# Altium project Antenna_base.PrjPcb
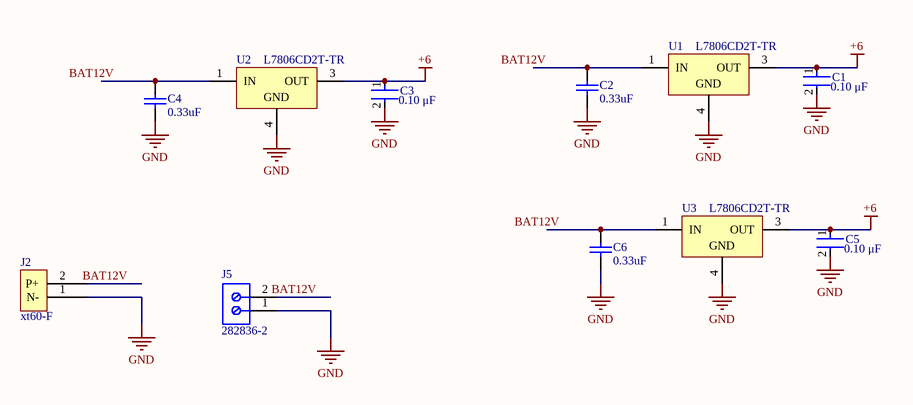
[diagram p0: 01_powersupply.SchDoc]
6 sheets, 95 parts. Net scope: global (net labels, ports and power ports of the same name join across sheets).
Board file: Antenna_base.PcbDoc
Sheets:
  01_powersupply.SchDoc
  02_USB2UART.SchDoc
  03_pushswitch.SchDoc
  04_IMU.SchDoc
  05_PWMdriver.SchDoc
  08_CoreBoard.SchDoc

## Sheet 01_powersupply.SchDoc
size A

### Parts
C1  Capacitance: 0.10 μF  [FP-C0603C-CF-MFG]  (hidden comment: C0603C104M4RAC7411)
C2  value 0.33uF  [CAPC1608X90X20LL10]  (hidden comment: C1608X7R1H334K080AC)
C3  Capacitance: 0.10 μF  [FP-C0603C-CF-MFG]  (hidden comment: C0603C104M4RAC7411)
C4  value 0.33uF  [CAPC1608X90X20LL10]  (hidden comment: C1608X7R1H334K080AC)
C5  Capacitance: 0.10 μF  [FP-C0603C-CF-MFG]  (hidden comment: C0603C104M4RAC7411)
C6  value 0.33uF  [CAPC1608X90X20LL10]  (hidden comment: C1608X7R1H334K080AC)
J2  xt60-F  [XT60H-F]
J5  282836-2  [TECO-282836-2_V]
U1  L7806CD2T-TR  [TO-263_L]
U2  L7806CD2T-TR  [TO-263_L]
U3  L7806CD2T-TR  [TO-263_L]

### Nets
+6: C1.1 C3.1 C5.1 U1.3(OUT) U2.3(OUT) U3.3(OUT)  [project net PWM_VDD]
GND: C1.2 C2.1 C3.2 C4.1 C5.2 C6.1 J2.1(N-) J5.1 U1.4(GND) U2.4(GND) U3.4(GND)
BAT12V: C2.2 C4.2 C6.2 J2.2(P+) J5.2 U1.1(IN) U2.1(IN) U3.1(IN)

### Library data of the parts
C1 C3 C5 = CMP-03020-016578-1: CAP CER 0.1UF 16V X7R 0603; Manufacturer: KEMET; Tolerance: 0.2; Value: 0.10 μF; Automotive Grade: Grade 1; Material: Ceramic; Temperature Coefficient: 30ppm/°C; RoHS: TRUE; Temperature: -55°C to +125°C; Automotive: Yes; Device Class L3: Ceramic Capacitors; Temperature Characteristic: X7R; Package: C0603C-CF; Digikey Description: CAP CER 0.1UF 16V X7R 0603; Manufacturer Part Number: C0603C104M4RAC7411; ComponentLink2URL: https://api.kemet.com/component-edge/download/datasheet/C0603C100J5GACAUTO.pdf; Mouser Description: Multilayer Ceramic Capacitors MLCC - SMD/SMT 16volts 0.1uF X7R 20%; Voltage Rating: 16 V; Temperature Range High: +125°C; Temperature Range Low: -55°C; Height: 0.87mm; Device Class L1: Passive Components; ComponentLink2Description: Datasheet; Lead Free: Yes; Category: Cap; Device Class L2: Capacitors; Octopart: https://octopart.com/c0603c104m4rac7411-kemet-9138805
C2 C4 C6 = CMP-2000-07551-1: Chip Capacitor, 0.33 uF, +/- 10%, 50 V, -55 to 125 degC, 0603 (1608 Metric), RoHS, Tape and Reel; Manufacturer: TDK; Datasheet URL: https://product.tdk.com/info/en/catalog/datasheets/mlcc_commercial_general_en.pdf; Manufacturer URL: http://www.tdk.com/; Package Description: 2-Pin Surface Mount Device, Body 1.6 x 0.8 mm; Mounting Technology: SurfaceMount; Datasheet Version: 07/2017; Package Reference: 603
J2 = xt60
J5 = CMP-1684-00017-1: Female Header, Pitch 5 mm, 1 x 2 Position, Height 10 mm, Tail Length 3.5 mm, Rohs, Bulk; Manufacturer: TE Connectivity; Wire Gauge: 16-30AWG; Product Training Modules: Wire-to-BoardEurostyleTerminalBlocks; Clamp Material - Plating: Brass-NickelPlated; Voltage: 300V; Mating Orientation: HorizontalwithBoard; Current: 13.5A; Pitch: 0.197"(5.00mm); Screw Thread: M3; 3D Model: 282836-2.pdf; Other Names: 5ULV-02B / A98076; Dynamic Catalog: BuchananSeries; Number of Levels: 1; Torque - Screw: 0.68Nm(6Lb-In); Featured Product: EurostyleTerminalBlockConnectors; Positions Per Level: 2; Wire Termination: Screw-RisingCageClamp; Datasheet URL: http://www.te.com.cn/commerce/DocumentDelivery/DDEController?Action=showdoc&DocId=Catalog+Section%7F1308389_EUROSTYLE_TERMINAL_BLOCKS%7F0607%7Fpdf%7FEnglish%7FENG_CS_1308389_EUROSTYLE_TERMINAL_BLOCKS_0607.pdf%7F282836-2; Color: Green; Family: TerminalBlocks-WiretoBoard; RoHS Information: 282836-2StatementofCompliance; Standard Package: 300; Contact Material - Plating: Brass-TinPlated; Manufacturer URL: http://www.te.com; Housing Material: Polyamide(PA66),Nylon6/6; Features: Interlocking(Side); Package Description: Female Header, Pitch 5 mm, 1 x 2 Position, Height 10 mm, Tail Length 3.5 mm; Mounting Type: ThroughHole; Package Reference: THD; Packaging: Bulk; Series: Buchanan; Category: Connectors,Interconnects; Screw Material - Plating: Brass-NickelPlated
U1-U3 = CMP-0244-00208-1: Positive Voltage Regulator, 3-Pin D2PAK, Tape and Reel; PackageDescription: 3-Pin Transistor Outline Package 2.54 mm Pitch, 15.4 mm Lead Span (D2PAK); ComponentLink1Description: Manufacturer URL; ComponentLink2URL: http://www.st.com/internet/com/TECHNICAL_RESOURCES/TECHNICAL_LITERATURE/DATASHEET/CD00000444.pdf; ComponentLink1URL: http://www.st.com; ComponentLink2Description: Datasheet; DatasheetVersion: 16/11/2011; PackageReference: TO-263; PackageVersion: 2011

## Sheet 02_USB2UART.SchDoc
size Letter
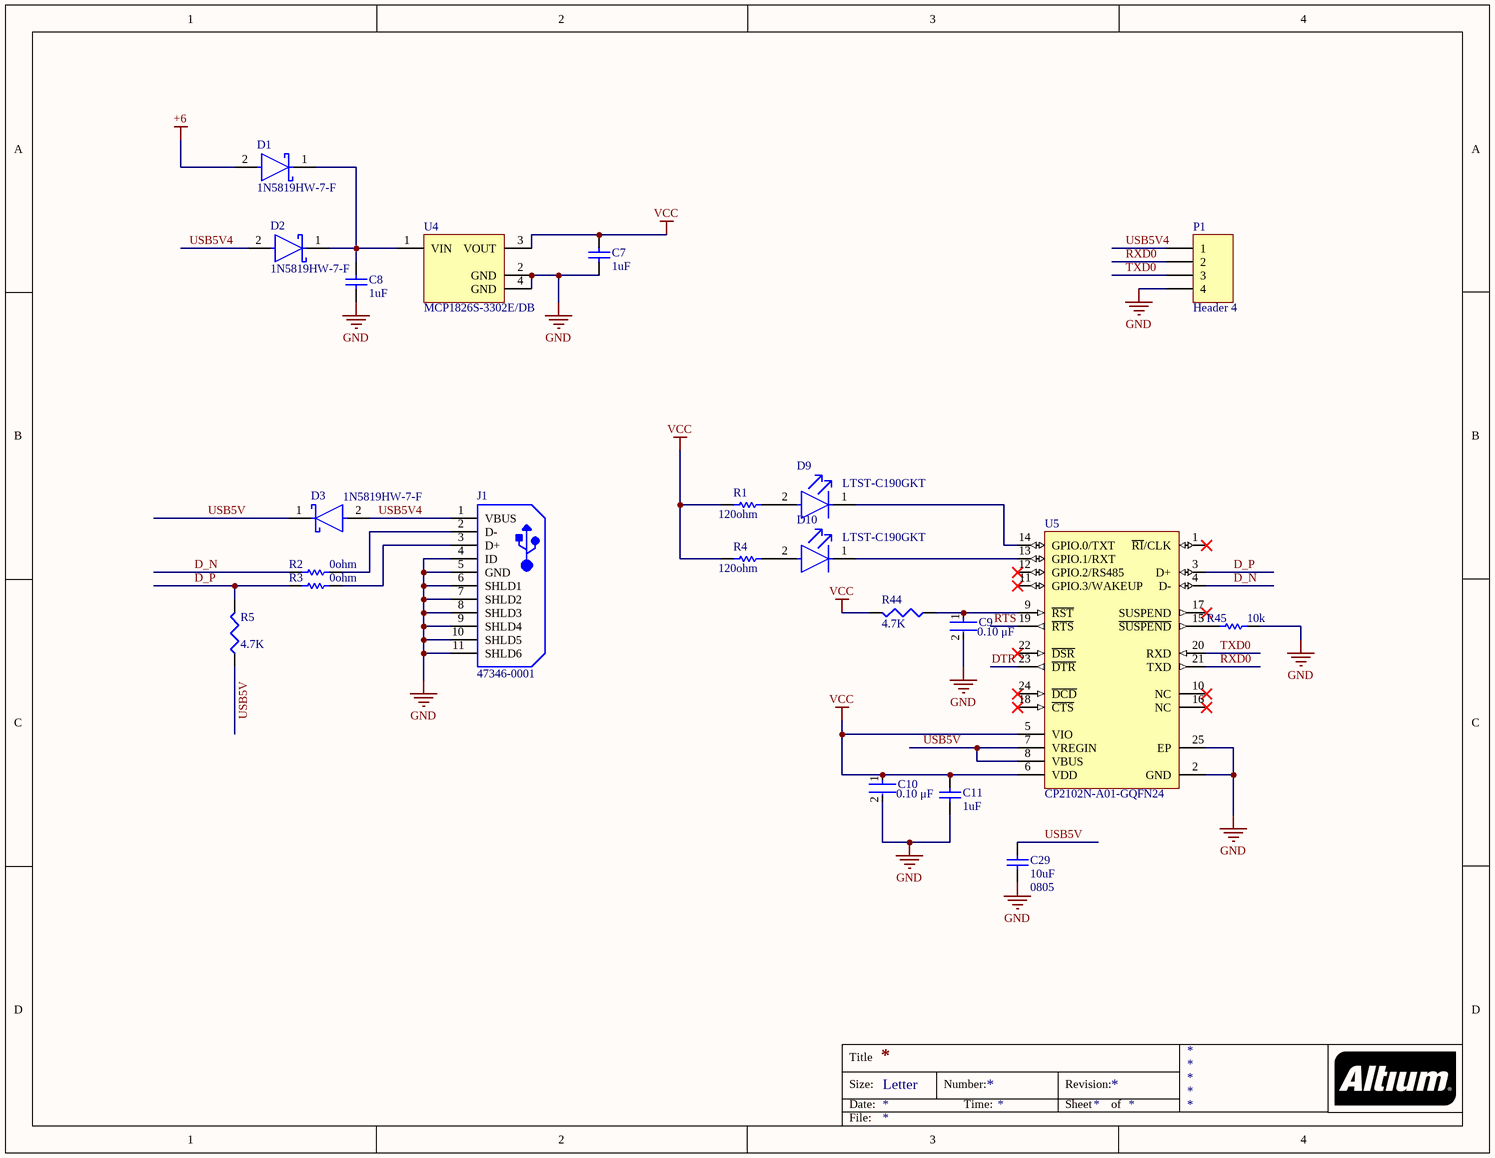
[diagram p1: 02_USB2UART.SchDoc]

### Parts
C7  value 1uF  [CAPC1608X87X35LL15T15]  (hidden comment: C0603C101J1GACTU)
C8  value 1uF  [CAPC1608X87X35LL15T15]  (hidden comment: C0603C101J1GACTU)
C9  Capacitance: 0.10 μF  [FP-C0603C-CF-MFG]  (hidden comment: C0603C104M4RAC7411)
C10  Capacitance: 0.10 μF  [FP-C0603C-CF-MFG]  (hidden comment: C0603C104M4RAC7411)
C11  value 1uF  [CAPC1608X87X35LL15T15]  (hidden comment: C0603C101J1GACTU)
C29  value 10uF  Package: 0805  [CAPC2013X135X50LL10T20]  (hidden comment: GRM21BR61C106KE15L)
D1  1N5819HW-7-F  [FP-SOD123-MFG]
D2  1N5819HW-7-F  [FP-SOD123-MFG]
D3  1N5819HW-7-F  [FP-SOD123-MFG]
D9  LTST-C190GKT  [FP-LTST-C190GKT-MFG]
D10  LTST-C190GKT  [FP-LTST-C190GKT-MFG]
J1  47346-0001  [MOLX-47346-0001-5_V]
P1  Header 4  [HDR1X4]
R1  value 120ohm  [RESC1608X55X30NL20T20]  (hidden comment: ERA-3AEB121V)
R2  value 0ohm  [RESC1608X55X25ML10T15]  (hidden comment: RC0603JR-070RL)
R3  value 0ohm  [RESC1608X55X25ML10T15]  (hidden comment: RC0603JR-070RL)
R4  value 120ohm  [RESC1608X55X30NL20T20]  (hidden comment: ERA-3AEB121V)
R5  4.7k  [J1-0603]
R44  4.7k  [J1-0603]
R45  value 10k  [RESC1609X55X30LL15T15]  (hidden comment: ERJ3EKF1002V)
U4  MCP1826S-3302E/DB  [SOT-223-DB3_L]
U5  CP2102N-A01-GQFN24  [SLAB-QFN-24-2550x2550TP_A_V]

### Nets
+6: D1.2(A)  [project net PWM_VDD]
GND: C7.1 C8.1 C9.2 C10.2 C11.1 C29.1 J1.4(ID) J1.5(GND) J1.6(SHLD1) J1.7(SHLD2) J1.8(SHLD3) J1.9(SHLD4) J1.10(SHLD5) J1.11(SHLD6) P1.4 R45.2 U4.2(GND) U4.4(GND) U5.2(GND) U5.25(EP)
VCC: C7.2 C10.1 C11.2 R1.1 R4.1 R44.2 U4.3(VOUT) U5.5(VIO) U5.6(VDD)
D_N: R2.1 U5.4(D-)
D_P: R3.1 R5.2 U5.3(D+)
DTR: U5.23(~{DTR})
RTS: U5.19(~{RTS})
RXD0: P1.2 U5.21(TXD)
TXD0: P1.3 U5.20(RXD)
USB5V: C29.2 D3.1(C) R5.1 U5.7(VREGIN) U5.8(VBUS)
USB5V4: D2.2(A) D3.2(A) J1.1(VBUS) P1.1
NetC8_2: C8.2 D1.1(C) D2.1(C) U4.1(VIN)
NetC9_1: C9.1 R44.1 U5.9(~{RST})
NetD9_1: D9.1(C) U5.14(GPIO.0/TXT)
NetD9_2: D9.2(A) R1.2
NetD10_1: D10.1(C) U5.13(GPIO.1/RXT)
NetD10_2: D10.2(A) R4.2
NetJ1_2: J1.2(D-) R2.2
NetJ1_3: J1.3(D+) R3.2
NetR45_1: R45.1 U5.15(~{SUSPEND})

Not connected (* = marked no-connect by the designer): U5 1(~{RI}/CLK)* 10(NC)* 11(GPIO.3/WAKEUP)* 12(GPIO.2/RS485)* 16(NC)* 17(SUSPEND)* 18(~{CTS})* 22(~{DSR})* 24(~{DCD})*

### Notes on the sheet
- Title
- Size:
- Date:
- Letter
- Number:
- Time:
- Revision:
- Sheet
- of
- File:

### Library data of the parts
C7 C8 C11 = CMP-2006-03318-1: Manufacturer: Kemet; Part Number: C0603C101J1GACTU
C9 C10 = CMP-03020-016578-1: as C1 on sheet 01_powersupply; RoHS: TRUE; Temperature: -55°C to +125°C; Automotive: Yes; Device Class L3: Ceramic Capacitors; Temperature Characteristic: X7R; Package: C0603C-CF; Digikey Description: CAP CER 0.1UF 16V X7R 0603; Manufacturer Part Number: C0603C104M4RAC7411; ComponentLink2URL: https://api.kemet.com/component-edge/download/datasheet/C0603C100J5GACAUTO.pdf; Mouser Description: Multilayer Ceramic Capacitors MLCC - SMD/SMT 16volts 0.1uF X7R 20%; Voltage Rating: 16 V; Temperature Range High: +125°C; Temperature Range Low: -55°C; Height: 0.87mm; Device Class L1: Passive Components; ComponentLink2Description: Datasheet; Lead Free: Yes; Category: Cap; Device Class L2: Capacitors; Octopart: https://octopart.com/c0603c104m4rac7411-kemet-9138805
C29 = CMP-2007-03453-1: Manufacturer: Murata; Part Number: GRM21BR61C106KE15L
D1-D3 = CMP-12790-000018-1: DIODE SCHOTTKY 40V 1A SOD123; Manufacturer: Diodes Inc; Max Surge Forward Current: 25A; Peak Reverse Current: 1mA; Max Junction Temp: +125°C; Import Ts: 1521843113; Vr V: 40; Standoff Height: 0mm; Capacitance: 50pF; Value: 50pF; Ciiva Ids: 815630; If A: 1; Automotive: No; Device Class L1: Discrete Semiconductors; Octopart: https://octopart.com/1n5819hw-7-f-diodes+inc.-323197; Terminal Temperature Tt Degc: 90; ComponentLink2Description: Datasheet; Temperature Range High: +125°C; Package: SOD123; Reverse Voltage: 40V; Temperature Range Low: -65°C; Mouser Description: 1N5819HW Series 40 V 1 A Surface Mount Schottky Barrier Rectifier - SOD-123; Device Class L2: Diodes; Lead Free: Yes; Max Repetitive Reverse Voltage: 40V; Ipc Land Pattern Name: SOD365155X123-2; Forward Current: 1A; Device Class L3: Schottky Diodes; Digikey Description: DIODE SCHOTTKY 40V 1A SOD123; ComponentLink2URL: https://www.diodes.com/assets/Datasheets/ds30217.pdf; Footprint Url: https://www.diodes.com/assets/Package-Files/SOD123.pdf; RoHS: TRUE; Category: Diode; Height: 1.45mm; Release Date: 1385348939; Manufacturer Part Number: 1N5819HW-7-F; Temperature: -65°C to +125°C
D9 D10 = CMP-22017-000005-1: LED GREEN CLEAR CHIP SMD; Reverse Voltage: 5V; Power Dissipation: 100mW; Forward Voltage: 2.1V; Test Current: 10mA; Number of LEDs: 1; Viewing Angle: 130°; Forward Current: 30mA; Voltage: 2V; Wavelength: 565nm; Dominant Wavelength: 569nm; Luminous Intensity: 6mcd; Lens Color: Colorless; Packaging: Tape and Reel; Lens Transparency: Clear; Min Operating Temperature: -55°C; Case Code (Metric): 1608; Lens Style: Clear; Case/Package: 0603; Mount: Surface Mount; Package Quantity: 1; Height: 0.8mm; Illumination Color: Green; Radiation Hardening: No; Depth: 0.8mm; Number of Pins: 2; Max Operating Temperature: 85°C; Color: Green; Number of Elements: 1; Power Rating: 100mW; Case Code (Imperial): 0603; Width: 0.8mm; Length: 1.6mm; Lead Free: Lead Free
J1 = CMP-2000-05246-1: Micro-USB B Receptacle with Flange, -30 to 85 degC, 5-Pin SMD, RoHS, Tape and Reel; Manufacturer: Molex; Number of Contacts: 5; Body Orientation: RightAngle; Maximum Voltage Rating: 30VAC; Pitch: 0.65mm; Maximum Current Rating: 1.8/ContactA; Number of Ports: 1; Gender: RCP; Operating Temperature: -30to85C; Part No: 47346-0001; Color: Black; Termination Method: Solder; Contact Plating: GoldOverPalladiumNickelOverNickel; Dimension: 7.8x5.43x2.94mm; Number of Terminals: 5; Datasheet Version: Dec-13; Datasheet URL: https://datasheet.ciiva.com/30075/304740473460001-io-nectors-30075527.pdf; Contact Material: CopperAlloy; RoHS: Yes; Housing Material: LiquidCrystalPolymer; Manufacturer URL: http://www.molex.com/; Packaging: EmbossedTapeandReel; Mounting: SurfaceMount; Type: MicroUSBTypeB
P1 = Header 4: Header, 4-Pin; LatestRevisionDate: 17-Jul-2002; LatestRevisionNote: Re-released for DXP Platform.; Publisher: Altium Limited
R1 R4 = CMP-2000-00896-1: Manufacturer: Panasonic; Part Number: ERA-3AEB121V
R2 R3 = CMP-2100-03667-1: Chip Resistor, 0 Ohm, +/- 5%, 0.1 W, -55 to 155 degC, 0603 (1608 Metric), RoHS, Tape and Reel; Manufacturer: Yageo; Temperature Coefficient: 200ppm/degreesC; Voltage Rating: 50V; Power Rating: 100mW; Resistance: 0mOhm; Width: 0.8mm; Max Operating Temperature: 155degC; Tolerance: 5%; Package Reference: 0603; Height: 0.45mm; Depth: 0.8mm; Package Description: 2-Pin Surface Mount Device, Body 1.6 x 0.8 mm; Termination: SMD/SMT; Package Quantity: 5000; Case/Package: 0603; Case Code (Imperial): 0603; Radiation Hardening: No; Number of Pins: 2; Length: 1.6mm; Lead Free: LeadFree; Voltage Rating (DC): 50V; Military Standard: Not; Datasheet URL: http://www.yageo.com/NewPortal/yageodocoutput?fileName=/pdf/R-Chip/PYu-RC_Group_51_RoHS_L_5.pdf; Manufacturer URL: http://www.yageo.com/; Packaging: TapeandReel; Case Code (Metric): 1608; Min Operating Temperature: -55degC; Composition: ThickFilm; RoHSCompliant: true; Contact Plating: Tin; Datasheet Version: Rev. 5, 10/2016; REACH SVHC: NoSVHC
R5 R44 = Res3: Resistor; Published: 8-Jun-2000; LatestRevisionDate: 29-May-2009; LatestRevisionNote: IPC-7351 Footprint Added.; PackageReference: J1-0603; Publisher: Altium Limited; PackageDescription: Chip Resistor; Value: 4.7K
R45 = CMP-2000-07452-1: Chip Resistor, 10 KOhm, +/- 1%, 0.1 W, -55 to 155 degC, 0603 (1608 Metric), RoHS, Tape and Reel; Manufacturer: Panasonic; Voltage Rating: 75V; Case\/Package: 0603; Power Rating: 100mW; Resistance: 10KOhm; Temperature Coefficient: 100ppm\/degreesC; Number of Pins: 2; Package Reference: 603; Depth: 0.8mm; Mount: SurfaceMount; Package Description: 2-Pin Surface Mount Device, Body 1.6 x 0.85 mm; Datasheet Version: 02/2017; Length: 1.6mm; Lead Free: LeadFree; Height: 0.45mm; Number of Terminations: 2; Max Power Dissipation: 100mW; Min Operating Temperature: -55degC; Datasheet URL: https://industrial.panasonic.com/cdbs/www-data/pdf/RDA0000/AOA0000C304.pdf; Termination: SMD/SMT; Case Code (Metric): 1608; Case Code (Imperial): 0603; Tolerance: 1%; Max Operating Temperature: 155degC; RoHSCompliant: true; Voltage Rating (DC): 75V; Radiation Hardening: No; Packaging: TapeandReel; Composition: ThickFilm; Mounting Technology: SurfaceMount; Manufacturer URL: http://www.panasonic.com/; Width: 0.031inch; REACH SVHC: NoSVHC; Contact Plating: Tin; Military Standard: Not; Package Quantity: 1
U4 = CMP-0136-00504-1: 1000 mA, Low Voltage, Low Quiescent Current LDO Regulator, 3-Pin SOT-223, Extended Temperature; PackageVersion: revBB, Aug-2009; PackageReference: SOT-223-DB3; DatasheetVersion: revA, Aug-2007; PackageDescription: 3-Lead Plastic Small Outline Transistor (DB) [SOT-223]
U5 = CMP-2000-07570-1: USBXpress(TM) Family, 4 GPIOs, 2.2 to 3.6 V, -40 to 85 degC, 24-Pin QFN, RoHS; Manufacturer: Silicon Labs; Max Supply Voltage: 3.6V; Min Supply Voltage: 3V; Datasheet Version: Rev. 1.1, 08/2016; Max Operating Temperature: 85degC; Case\/Package: QFN; Number of Pins: 24; Min Operating Temperature: -40degC; Mounting Technology: SurfaceMount; Manufacturer URL: http://www.silabs.com/; RoHSCompliant: False; Package Reference: QFN-24-2550x2550TP_A; Datasheet URL: http://www.silabs.com/documents/public/data-sheets/cp2102n-datasheet.pdf; Package Description: 24-Pin Quad Flat No-lead Package, Body 4 x 4 mm, Pitch 0.5 mm; REACH SVHC: Unknown

## Sheet 03_pushswitch.SchDoc
size A
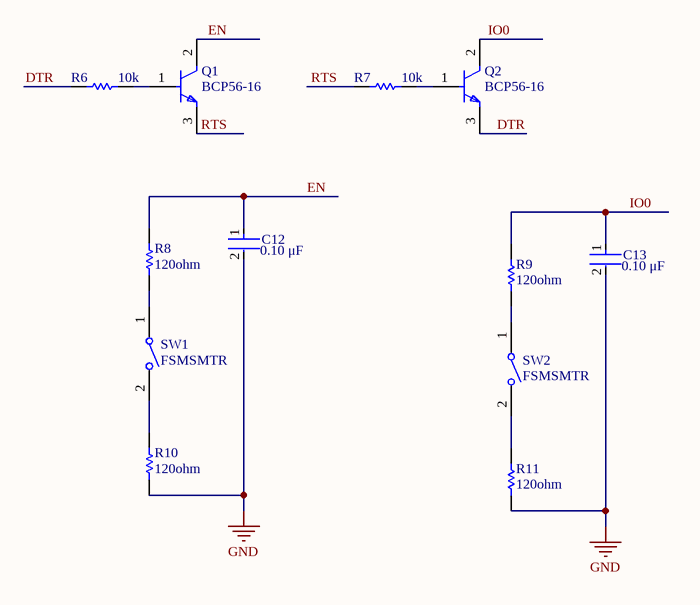
[diagram p2: 03_pushswitch.SchDoc]

### Parts
C12  Capacitance: 0.10 μF  [FP-C0603C-CF-MFG]  (hidden comment: C0603C104M4RAC7411)
C13  Capacitance: 0.10 μF  [FP-C0603C-CF-MFG]  (hidden comment: C0603C104M4RAC7411)
Q1  BCP56-16  [FP-SOT-223-P008-MFG]
Q2  BCP56-16  [FP-SOT-223-P008-MFG]
R6  value 10k  [RESC1609X55X30LL15T15]  (hidden comment: ERJ3EKF1002V)
R7  value 10k  [RESC1609X55X30LL15T15]  (hidden comment: ERJ3EKF1002V)
R8  value 120ohm  [RESC1608X55X30NL20T20]  (hidden comment: ERA-3AEB121V)
R9  value 120ohm  [RESC1608X55X30NL20T20]  (hidden comment: ERA-3AEB121V)
R10  value 120ohm  [RESC1608X55X30NL20T20]  (hidden comment: ERA-3AEB121V)
R11  value 120ohm  [RESC1608X55X30NL20T20]  (hidden comment: ERA-3AEB121V)
SW1  FSMSMTR  [TECO-FSMSMTR_V]
SW2  FSMSMTR  [TECO-FSMSMTR_V]

### Nets
GND: C12.2 C13.2 R10.1 R11.1
DTR: Q2.3(E) R6.1
EN: C12.1 Q1.2(C) R8.2
IO0: C13.1 Q2.2(C) R9.2
RTS: Q1.3(E) R7.1
NetQ1_1: Q1.1(B) R6.2
NetQ2_1: Q2.1(B) R7.2
NetR8_1: R8.1 SW1.1
NetR9_1: R9.1 SW2.1
NetR10_2: R10.2 SW1.2
NetR11_2: R11.2 SW2.2

### Library data of the parts
C12 C13 = CMP-03020-016578-1: as C1 on sheet 01_powersupply; RoHS: TRUE; Temperature: -55°C to +125°C; Automotive: Yes; Device Class L3: Ceramic Capacitors; Temperature Characteristic: X7R; Package: C0603C-CF; Digikey Description: CAP CER 0.1UF 16V X7R 0603; Manufacturer Part Number: C0603C104M4RAC7411; ComponentLink2URL: https://api.kemet.com/component-edge/download/datasheet/C0603C100J5GACAUTO.pdf; Mouser Description: Multilayer Ceramic Capacitors MLCC - SMD/SMT 16volts 0.1uF X7R 20%; Voltage Rating: 16 V; Temperature Range High: +125°C; Temperature Range Low: -55°C; Height: 0.87mm; Device Class L1: Passive Components; ComponentLink2Description: Datasheet; Lead Free: Yes; Category: Cap; Device Class L2: Capacitors; Octopart: https://octopart.com/c0603c104m4rac7411-kemet-9138805
Q1 Q2 = CMP-12195-000003-1: TRANS NPN 80V 1A SOT-223; Manufacturer: STMicroelectronics; Number Of Npn: 1; Hfe Max: 250; Hfe Min: 100; Power Dissipation: 1.6W; Collector Base Voltage: 100V; Emitter Base Voltage: 5V; Max Junction Temp: +150°C; Rthja Max: 78°C/W; Standoff Height: 0.02mm; Collector Emitter Saturation Voltage: 0.5V; Hfe Testvce: 2V; Hfe Testic: 150mA; Package: SOT-223-P008; Octopart: https://octopart.com/bcp56-16-stmicroelectronics-13883839; Digikey Description: TRANS NPN 80V 1A SOT-223; RoHS: TRUE; Device Class L1: Discrete Semiconductors; Manufacturer Part Number: BCP56-16; Collector Emitter Voltage: 80V; Mouser Description: BCP56 Series 80 V 1 A 1.6 W Surface Mount Low Power NPN Transistor - SOT-223; Collector Emitter Breakdown Voltage: 80V; Category: Trans; Automotive: No; Ipc Land Pattern Name: SOT230P700X180-4; Temperature: to +150°C; Number Of Elements: 1; Footprint Url: https://www.st.com/content/ccc/resource/technical/document/application_note/45/cc/69/ea/2f/8d/4e/3c/CD00004438.pdf/files/CD00004438.pdf/jcr:content/translations/en.CD00004438.pdf; ComponentLink2URL: https://www.st.com/resource/en/datasheet/bcp56-16.pdf; Device Class L2: Transistors; Temperature Range High: +150°C; Device Class L3: BJTs; Height: 1.82mm; ComponentLink2Description: Datasheet; Lead Free: Yes; Max Collector Current: 1A
R6 R7 = CMP-2000-07452-1: as R45 on sheet 02_USB2UART; Number of Pins: 2; Package Reference: 603; Depth: 0.8mm; Mount: SurfaceMount; Package Description: 2-Pin Surface Mount Device, Body 1.6 x 0.85 mm; Datasheet Version: 02/2017; Length: 1.6mm; Lead Free: LeadFree; Height: 0.45mm; Number of Terminations: 2; Max Power Dissipation: 100mW; Min Operating Temperature: -55degC; Datasheet URL: https://industrial.panasonic.com/cdbs/www-data/pdf/RDA0000/AOA0000C304.pdf; Termination: SMD/SMT; Case Code (Metric): 1608; Case Code (Imperial): 0603; Tolerance: 1%; Max Operating Temperature: 155degC; RoHSCompliant: true; Voltage Rating (DC): 75V; Radiation Hardening: No; Packaging: TapeandReel; Composition: ThickFilm; Mounting Technology: SurfaceMount; Manufacturer URL: http://www.panasonic.com/; Width: 0.031inch; REACH SVHC: NoSVHC; Contact Plating: Tin; Military Standard: Not; Package Quantity: 1
R8-R11 = CMP-2000-00896-1: Manufacturer: Panasonic; Part Number: ERA-3AEB121V
SW1 SW2 = CMP-2000-07501-1: FSMSM Push Button Switch, 50 mA, -35 to 85 degC, 2-Pin SMD, RoHS, Tape and Reel; Manufacturer: TE Connectivity; Voltage Rating (DC): 24V; Electrical Life: 20000Cycles; Operating Force: 180gf; Switch Travel: 0.25mm; Contact Current Rating: 50mA; Case\/Package: SMD/SMT; Actuator Length: 1.07mm; Throw Configuration: SPST; Actuator Material: Polyamide; Contact Resistance: 100mOhm; Illumination Type: Illuminated; Max Voltage Rating (DC): 12V; Manufacturer URL: http://www.te.com/; Lead Free: LeadFree; Packaging: TapeandReel; Min Operating Temperature: -35degC; Mechanical Life: 20000Cycles; Mount: SurfaceMount; REACH SVHC: Unknown; Package Quantity: 1800; Package Reference: FSMSMTR; RoHSCompliant: true; Max Operating Temperature: 85degC; Orientation: Straight; ELV: Compliant; Datasheet URL: http://www.te.com/commerce/DocumentDelivery/DDEController?Action=showdoc&DocId=Customer+Drawing%7F1437566-3%7FC2%7Fpdf%7FEnglish%7FENG_CD_1437566-3_C2_1437566_3_1_c.dwg.pdf%7F1437566-4; Package Description: 2-Pin Surface Mount Device, Body 6 x 3.5 mm, Pitch 9.19 mm; Current Rating: 50mA; Contact Plating: Silver; Termination: GullWing; Datasheet Version: Rev. C2, 08/2014; Contact Material: Brass; Mounting Technology: SurfaceMount

## Sheet 04_IMU.SchDoc
size A
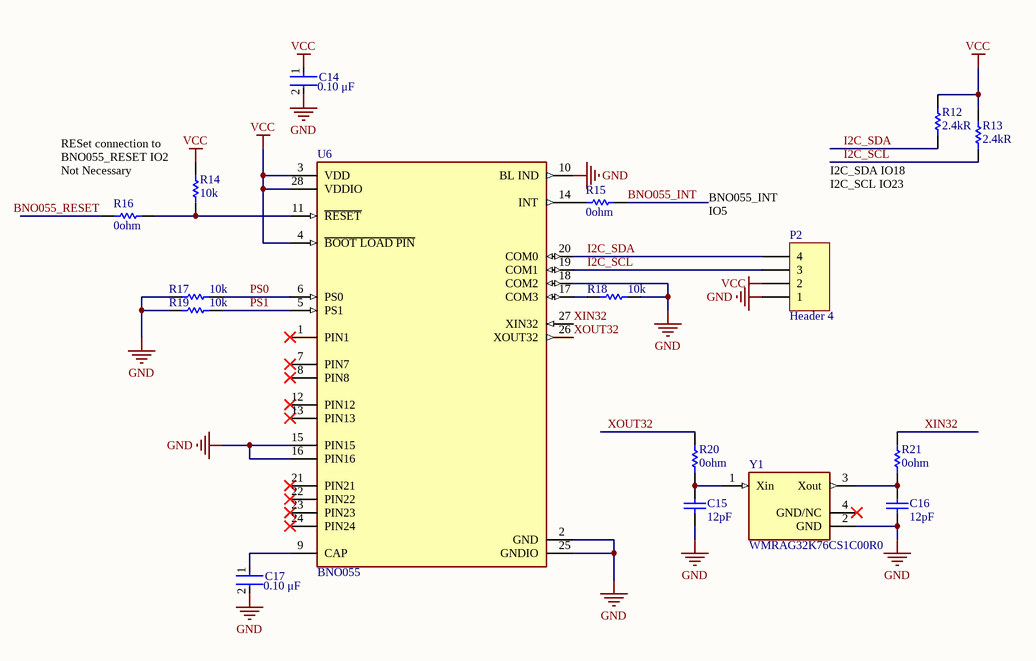
[diagram p3: 04_IMU.SchDoc]

### Parts
C14  Capacitance: 0.10 μF  [FP-C0603C-CF-MFG]  (hidden comment: C0603C104M4RAC7411)
C15  value 12pF  [CAPC1608X90X40NL10T20]  (hidden comment: CC0603JRNPO9BN120)
C16  value 12pF  [CAPC1608X90X40NL10T20]  (hidden comment: CC0603JRNPO9BN120)
C17  Capacitance: 0.10 μF  [FP-C0603C-CF-MFG]  (hidden comment: C0603C104M4RAC7411)
P2  Header 4  [HDR1X4]
R12  value 2.4kR  [RESC1608X50X30ML20T20]  (hidden comment: RR0816P-242-D)
R13  value 2.4kR  [RESC1608X50X30ML20T20]  (hidden comment: RR0816P-242-D)
R14  value 10k  [RESC1609X55X30LL15T15]  (hidden comment: ERJ3EKF1002V)
R15  value 0ohm  [RESC1608X55X25ML10T15]  (hidden comment: RC0603JR-070RL)
R16  value 0ohm  [RESC1608X55X25ML10T15]  (hidden comment: RC0603JR-070RL)
R17  value 10k  [RESC1609X55X30LL15T15]  (hidden comment: ERJ3EKF1002V)
R18  value 10k  [RESC1609X55X30LL15T15]  (hidden comment: ERJ3EKF1002V)
R19  value 10k  [RESC1609X55X30LL15T15]  (hidden comment: ERJ3EKF1002V)
R20  value 0ohm  [RESC1608X55X25ML10T15]  (hidden comment: RC0603JR-070RL)
R21  value 0ohm  [RESC1608X55X25ML10T15]  (hidden comment: RC0603JR-070RL)
U6  BNO055  [FP-BNO055-MFG]
Y1  WMRAG32K76CS1C00R0  [FP-WMRAG32K76CS1C00R0-MFG]

### Nets
GND: C14.2 C15.1 C16.1 C17.2 P2.1 R17.1 R18.1 R19.1 U6.2(GND) U6.10(BL_IND) U6.15(PIN15) U6.16(PIN16) U6.18(COM2) U6.25(GNDIO) Y1.2(GND)
VCC: C14.1 P2.2 R12.2 R13.2 R14.2 U6.3(VDD) U6.4(~{BOOT_LOAD_PIN}) U6.28(VDDIO)
BNO055_INT: R15.2
BNO055_RESET: R16.1
I2C_SCL: P2.3 R13.1 U6.19(COM1)
I2C_SDA: P2.4 R12.1 U6.20(COM0)
PS0: R17.2 U6.6(PS0)
PS1: R19.2 U6.5(PS1)
XIN32: R21.1 U6.27(XIN32)
XOUT32: R20.1 U6.26(XOUT32)
NetC15_2: C15.2 R20.2 Y1.1(Xin)
NetC16_2: C16.2 R21.2 Y1.3(Xout)
NetC17_1: C17.1 U6.9(CAP)
NetR14_1: R14.1 R16.2 U6.11(~{RESET})
NetR15_1: R15.1 U6.14(INT)
NetR18_2: R18.2 U6.17(COM3)

Not connected (* = marked no-connect by the designer): U6 1(PIN1)* 7(PIN7)* 8(PIN8)* 12(PIN12)* 13(PIN13)* 21(PIN21)* 22(PIN22)* 23(PIN23)* 24(PIN24)*; Y1 4(GND/NC)*

### Notes on the sheet
- RESet connection to
  BNO055_RESET IO2
  Not Necessary
- I2C_SDA IO18
  I2C_SCL IO23
- (near P2) BNO055_INT
  IO5

### Library data of the parts
C14 C17 = CMP-03020-016578-1: as C1 on sheet 01_powersupply; RoHS: TRUE; Temperature: -55°C to +125°C; Automotive: Yes; Device Class L3: Ceramic Capacitors; Temperature Characteristic: X7R; Package: C0603C-CF; Digikey Description: CAP CER 0.1UF 16V X7R 0603; Manufacturer Part Number: C0603C104M4RAC7411; ComponentLink2URL: https://api.kemet.com/component-edge/download/datasheet/C0603C100J5GACAUTO.pdf; Mouser Description: Multilayer Ceramic Capacitors MLCC - SMD/SMT 16volts 0.1uF X7R 20%; Voltage Rating: 16 V; Temperature Range High: +125°C; Temperature Range Low: -55°C; Height: 0.87mm; Device Class L1: Passive Components; ComponentLink2Description: Datasheet; Lead Free: Yes; Category: Cap; Device Class L2: Capacitors; Octopart: https://octopart.com/c0603c104m4rac7411-kemet-9138805
C15 C16 = CMP-1659-00031-1: Chip Capacitor, 12 pF, +/- 5%, 50 V, -55 to 125 degC, 0603 (1608 Metric), RoHS, Tape and Reel; Tolerance: 1%; Voltage Rating: 250 V; Case\Package: Axial; Power Rating: 250 mW; Resistance: 475 kohm; Mount: Through Hole; Length: 0.248 inch; PackageReference: 0603; DatasheetVersion: Rev. 14, 07/2016; Packaging: Bulk; Max Operating Temperature: 155 degC; Min Operating Temperature: -55 degC; ComponentLink2Description: Datasheet; ComponentLink2URL: http://www.yageo.com/NewPortal/yageodocoutput?fileName=/pdf/MLCC/UPY-GP_NP0_16V-to-50V_14.pdf; ComponentLink1URL: http://www.yageo.com/; PackageDescription: 2-Pin Surface Mount Device, Body 1.6 x 0.8 mm; Package Quantity: 200; RoHSCompliant: true; ComponentLink1Description: Manufacturer URL
P2 = Header 4: Header, 4-Pin; LatestRevisionDate: 17-Jul-2002; LatestRevisionNote: Re-released for DXP Platform.; Publisher: Altium Limited
R12 R13 = CMP-2000-02561-1: Manufacturer: Susumu; Part Number: RR0816P-242-D
R14 R17-R19 = CMP-2000-07452-1: as R45 on sheet 02_USB2UART; Number of Pins: 2; Package Reference: 603; Depth: 0.8mm; Mount: SurfaceMount; Package Description: 2-Pin Surface Mount Device, Body 1.6 x 0.85 mm; Datasheet Version: 02/2017; Length: 1.6mm; Lead Free: LeadFree; Height: 0.45mm; Number of Terminations: 2; Max Power Dissipation: 100mW; Min Operating Temperature: -55degC; Datasheet URL: https://industrial.panasonic.com/cdbs/www-data/pdf/RDA0000/AOA0000C304.pdf; Termination: SMD/SMT; Case Code (Metric): 1608; Case Code (Imperial): 0603; Tolerance: 1%; Max Operating Temperature: 155degC; RoHSCompliant: true; Voltage Rating (DC): 75V; Radiation Hardening: No; Packaging: TapeandReel; Composition: ThickFilm; Mounting Technology: SurfaceMount; Manufacturer URL: http://www.panasonic.com/; Width: 0.031inch; REACH SVHC: NoSVHC; Contact Plating: Tin; Military Standard: Not; Package Quantity: 1
R15 R16 R20 R21 = CMP-2100-03667-1: as R2 on sheet 02_USB2UART; Width: 0.8mm; Max Operating Temperature: 155degC; Tolerance: 5%; Package Reference: 0603; Height: 0.45mm; Depth: 0.8mm; Package Description: 2-Pin Surface Mount Device, Body 1.6 x 0.8 mm; Termination: SMD/SMT; Package Quantity: 5000; Case/Package: 0603; Case Code (Imperial): 0603; Radiation Hardening: No; Number of Pins: 2; Length: 1.6mm; Lead Free: LeadFree; Voltage Rating (DC): 50V; Military Standard: Not; Datasheet URL: http://www.yageo.com/NewPortal/yageodocoutput?fileName=/pdf/R-Chip/PYu-RC_Group_51_RoHS_L_5.pdf; Manufacturer URL: http://www.yageo.com/; Packaging: TapeandReel; Case Code (Metric): 1608; Min Operating Temperature: -55degC; Composition: ThickFilm; RoHSCompliant: true; Contact Plating: Tin; Datasheet Version: Rev. 5, 10/2016; REACH SVHC: NoSVHC
U6 = CMP-191067-000002-1: IMU ACCEL/GYRO/MAG I2C 28LGA; Manufacturer: Bosch Sensortech; Max Supply Voltage: 3.6V; Voltage: 1.7~3.6V; Operating Supply Current: 12.3mA; Gyro Sensitivity: 16LSB/°/s; Sensor Type: Accelerometer,Gyroscope,Magnetometer; Accel Sensitivity: 0.001LSB/g; Min Supply Voltage: 1.7V; Accel Range: 2/4/8/16g; Accel Resolution: 14bits; Sensor Output: I2C,UART; Gyro Range: 125/250/500/1000/2000°/s; Mag Sense Range: 1300-2500uT; Octopart: https://octopart.com/bno055-bosch+sensortec-50309911; Height: 1.18mm; Automotive: No; Mouser Description: BNO055 Series 1.7 to 3.6 V Intelligent 9-Axis Absolute Orientation Sensor-LGA-28; Lead Free: Yes; Temperature Range High: +85°C; Ambient Temperature Range Low: -40°C; Ambient Temperature Range High: +85°C; Device Class L1: Sensors; Device Class L3: Inertial Measurement Units (IMUs); ComponentLink2URL: https://ae-bst.resource.bosch.com/media/_tech/media/datasheets/BST-BNO055-DS000.pdf; Temperature Range Low: -40°C; Manufacturer Part Number: BNO055; Digikey Description: IMU ACCEL/GYRO/MAG I2C 28LGA; Device Class L2: Motion Sensors; RoHS: TRUE; Category: IC; Temperature: -40°C to +85°C; ComponentLink2Description: Datasheet; Package: 0
Y1 = CMP-06054-000002-1: MEMS Resonator; Manufacturer: Murata; Tolerance: 20ppm; Frequency: 32.768kHz; Esr: 75kΩ; Load Capacitance: 8pF; Temperature Range High: +85°C; Manufacturer Part Number: WMRAG32K76CS1C00R0; Device Class L2: Crystals / Oscillators; Category: Crys; ComponentLink2URL: https://www.murata.com/en-us/products/productdetail?partno=WMRAG32K76CS1C00R0; Package: WMRAG32K76CS1C00R0; Temperature: -30°C to +85°C; Automotive: No; Device Class L1: Passive Components; Octopart: https://octopart.com/wmrag32k76cs1c00r0-murata-103936783; ComponentLink2Description: Datasheet; RoHS: TRUE; Lead Free: Yes; Device Class L3: Crystals; Footprint Url: https://forum.upverter.com/uploads/default/original/3X/c/9/c928dfaf44ae48bfe51164a60c1d28063cd1860b.pdf; Temperature Range Low: -30°C

## Sheet 05_PWMdriver.SchDoc
size A
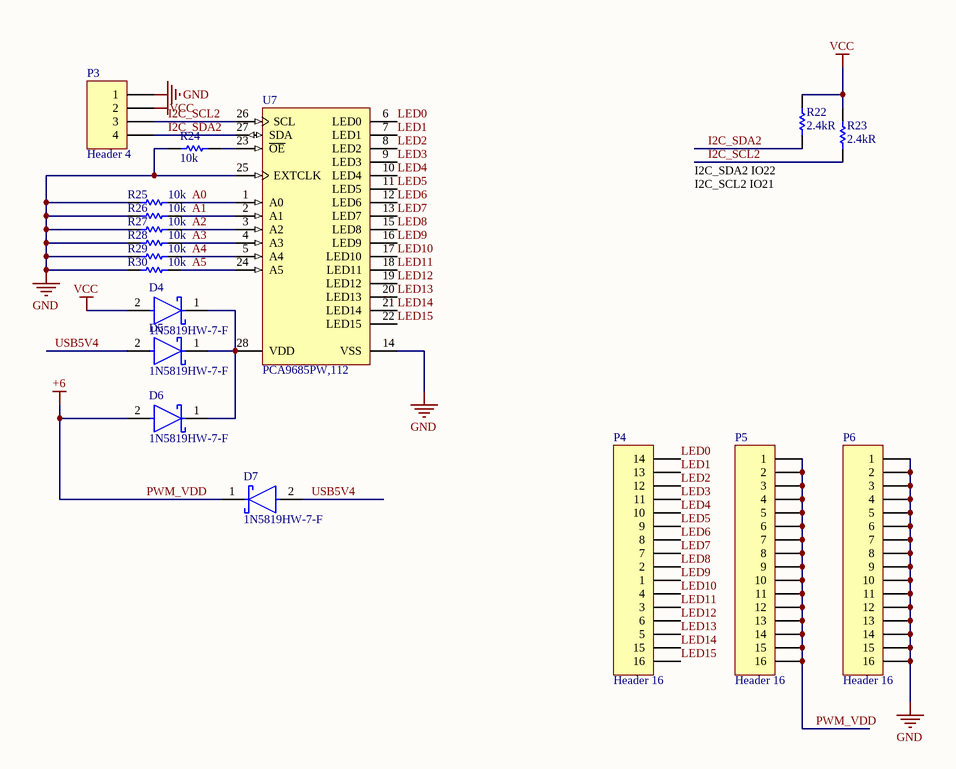
[diagram p4: 05_PWMdriver.SchDoc]

### Parts
D4  1N5819HW-7-F  [FP-SOD123-MFG]
D5  1N5819HW-7-F  [FP-SOD123-MFG]
D6  1N5819HW-7-F  [FP-SOD123-MFG]
D7  1N5819HW-7-F  [FP-SOD123-MFG]
P3  Header 4  [HDR1X4]
P4  Header 16  [HDR1X16]
P5  Header 16  [HDR1X16]
P6  Header 16  [HDR1X16]
R22  value 2.4kR  [RESC1608X50X30ML20T20]  (hidden comment: RR0816P-242-D)
R23  value 2.4kR  [RESC1608X50X30ML20T20]  (hidden comment: RR0816P-242-D)
R24  value 10k  [RESC1609X55X30LL15T15]  (hidden comment: ERJ3EKF1002V)
R25  value 10k  [RESC1609X55X30LL15T15]  (hidden comment: ERJ3EKF1002V)
R26  value 10k  [RESC1609X55X30LL15T15]  (hidden comment: ERJ3EKF1002V)
R27  value 10k  [RESC1609X55X30LL15T15]  (hidden comment: ERJ3EKF1002V)
R28  value 10k  [RESC1609X55X30LL15T15]  (hidden comment: ERJ3EKF1002V)
R29  value 10k  [RESC1609X55X30LL15T15]  (hidden comment: ERJ3EKF1002V)
R30  value 10k  [RESC1609X55X30LL15T15]  (hidden comment: ERJ3EKF1002V)
U7  PCA9685PW,112  [SOT361-1_V]

### Nets
GND: P3.1 P6.1 P6.2 P6.3 P6.4 P6.5 P6.6 P6.7 P6.8 P6.9 P6.10 P6.11 P6.12 P6.13 P6.14 P6.15 P6.16 R24.2 R25.2 R26.2 R27.2 R28.2 R29.2 R30.2 U7.14(VSS) U7.25(EXTCLK)
PWM_VDD: D6.2(A) D7.1(C) P5.1 P5.2 P5.3 P5.4 P5.5 P5.6 P5.7 P5.8 P5.9 P5.10 P5.11 P5.12 P5.13 P5.14 P5.15 P5.16  [also labelled +6]
VCC: D4.2(A) P3.2 R22.2 R23.2
A0: R25.1 U7.1(A0)
A1: R26.1 U7.2(A1)
A2: R27.1 U7.3(A2)
A3: R28.1 U7.4(A3)
A4: R29.1 U7.5(A4)
A5: R30.1 U7.24(A5)
I2C_SCL2: P3.3 R23.1 U7.26(SCL)
I2C_SDA2: P3.4 R22.1 U7.27(SDA)
LED0: P4.14 U7.6(LED0)
LED1: P4.13 U7.7(LED1)
LED2: P4.12 U7.8(LED2)
LED3: P4.11 U7.9(LED3)
LED4: P4.10 U7.10(LED4)
LED5: P4.9 U7.11(LED5)
LED6: P4.8 U7.12(LED6)
LED7: P4.7 U7.13(LED7)
LED8: P4.2 U7.15(LED8)
LED9: P4.1 U7.16(LED9)
LED10: P4.4 U7.17(LED10)
LED11: P4.3 U7.18(LED11)
LED12: P4.6 U7.19(LED12)
LED13: P4.5 U7.20(LED13)
LED14: P4.15 U7.21(LED14)
LED15: P4.16 U7.22(LED15)
USB5V4: D5.2(A) D7.2(A)
NetD4_1: D4.1(C) D5.1(C) D6.1(C) U7.28(VDD)
NetR24_1: R24.1 U7.23(~{OE})

### Notes on the sheet
- I2C_SDA2 IO22
  I2C_SCL2 IO21

### Library data of the parts
D4-D7 = CMP-12790-000018-1: as D1 on sheet 02_USB2UART; Automotive: No; Device Class L1: Discrete Semiconductors; Octopart: https://octopart.com/1n5819hw-7-f-diodes+inc.-323197; Terminal Temperature Tt Degc: 90; ComponentLink2Description: Datasheet; Temperature Range High: +125°C; Package: SOD123; Reverse Voltage: 40V; Temperature Range Low: -65°C; Mouser Description: 1N5819HW Series 40 V 1 A Surface Mount Schottky Barrier Rectifier - SOD-123; Device Class L2: Diodes; Lead Free: Yes; Max Repetitive Reverse Voltage: 40V; Ipc Land Pattern Name: SOD365155X123-2; Forward Current: 1A; Device Class L3: Schottky Diodes; Digikey Description: DIODE SCHOTTKY 40V 1A SOD123; ComponentLink2URL: https://www.diodes.com/assets/Datasheets/ds30217.pdf; Footprint Url: https://www.diodes.com/assets/Package-Files/SOD123.pdf; RoHS: TRUE; Category: Diode; Height: 1.45mm; Release Date: 1385348939; Manufacturer Part Number: 1N5819HW-7-F; Temperature: -65°C to +125°C
P3 = Header 4: Header, 4-Pin; LatestRevisionDate: 17-Jul-2002; LatestRevisionNote: Re-released for DXP Platform.; Publisher: Altium Limited
P4-P6 = Header 16: Header, 16-Pin; LatestRevisionDate: 17-Jul-2002; LatestRevisionNote: Re-released for DXP Platform.; Publisher: Altium Limited
R22 R23 = CMP-2000-02561-1: Manufacturer: Susumu; Part Number: RR0816P-242-D
R24-R30 = CMP-2000-07452-1: as R45 on sheet 02_USB2UART; Number of Pins: 2; Package Reference: 603; Depth: 0.8mm; Mount: SurfaceMount; Package Description: 2-Pin Surface Mount Device, Body 1.6 x 0.85 mm; Datasheet Version: 02/2017; Length: 1.6mm; Lead Free: LeadFree; Height: 0.45mm; Number of Terminations: 2; Max Power Dissipation: 100mW; Min Operating Temperature: -55degC; Datasheet URL: https://industrial.panasonic.com/cdbs/www-data/pdf/RDA0000/AOA0000C304.pdf; Termination: SMD/SMT; Case Code (Metric): 1608; Case Code (Imperial): 0603; Tolerance: 1%; Max Operating Temperature: 155degC; RoHSCompliant: true; Voltage Rating (DC): 75V; Radiation Hardening: No; Packaging: TapeandReel; Composition: ThickFilm; Mounting Technology: SurfaceMount; Manufacturer URL: http://www.panasonic.com/; Width: 0.031inch; REACH SVHC: NoSVHC; Contact Plating: Tin; Military Standard: Not; Package Quantity: 1
U7 = CMP-1595-00004-2: 16-Channel, 12-Bit PWM Fm+ I2C-Bus LED Controller, 2.3 to 5.5 V, -40 to 85 degC, 28-Pin TSSOP (SOT361-1), RoHS, Tape and Reel; Supply Current Max: 10 mA; Supply Voltage Min: 2.3 V; Supply Voltage Max: 5.5 V; Frequency: 25000000 Hz; Temperature Min: -40 degC; PackageDescription: 28-Pin Small Outline Package, Body 9.7 x 4.4 mm, Pitch 0.65 mm; RoHS: TRUE; ComponentLink1Description: Manufacturer URL; Code_JEDEC: MO-153; PartNumber: PCA9685; ComponentLink2URL: http://www.nxp.com/documents/data_sheet/PCA9685.pdf; Packing: Tape and Reel; ComponentLink1URL: http://www.nxp.com/; ComponentLink3Description: Package Specification; ComponentLink2Description: Datasheet; ComponentLink3URL: http://www.nxp.com/documents/outline_drawing/sot361-1_po.pdf; DatasheetVersion: Rev. 4; Temperature Max: 85 degC; PackageVersion: 02/2003; Mounting Technology: Surface Mount

## Sheet 08_CoreBoard.SchDoc
size A3
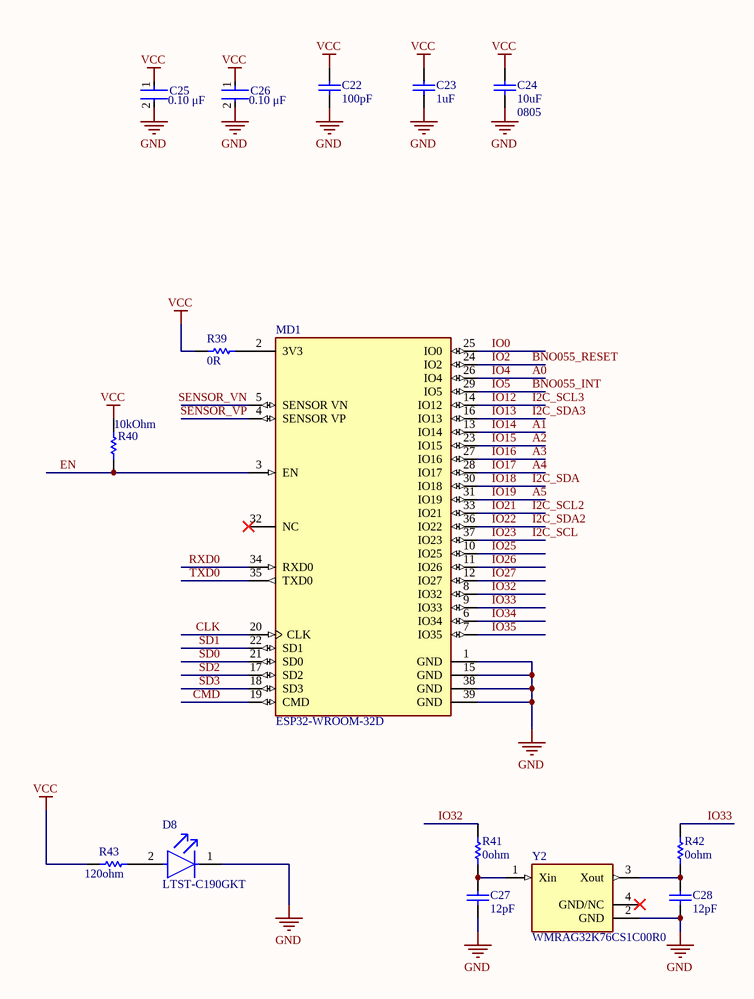
[diagram p5: 08_CoreBoard.SchDoc]

### Parts
C22  value 100pF  [CAPC1608X87X35LL15T15]  (hidden comment: C0603C101J1GACTU)
C23  value 1uF  [CAPC1608X87X35LL15T15]  (hidden comment: C0603C101J1GACTU)
C24  value 10uF  Package: 0805  [CAPC2013X135X50LL10T20]  (hidden comment: GRM21BR61C106KE15L)
C25  Capacitance: 0.10 μF  [FP-C0603C-CF-MFG]  (hidden comment: C0603C104M4RAC7411)
C26  Capacitance: 0.10 μF  [FP-C0603C-CF-MFG]  (hidden comment: C0603C104M4RAC7411)
C27  value 12pF  [CAPC1608X90X40NL10T20]  (hidden comment: CC0603JRNPO9BN120)
C28  value 12pF  [CAPC1608X90X40NL10T20]  (hidden comment: CC0603JRNPO9BN120)
D8  LTST-C190GKT  [FP-LTST-C190GKT-MFG]
MD1  ESP32-WROOM-32D  [FP-ESP32-WROOM-32D-MFG]
R39  value 0R  [RESC1608X55X25ML10T15]  (hidden comment: RC0603JR-070RL)
R40  Resistance: 10kOhm  [RESC1608X55X25ML10T15]  (hidden comment: RC0603JR-0710KL)
R41  value 0ohm  [RESC1608X55X25ML10T15]  (hidden comment: RC0603JR-070RL)
R42  value 0ohm  [RESC1608X55X25ML10T15]  (hidden comment: RC0603JR-070RL)
R43  value 120ohm  [RESC1608X55X30NL20T20]  (hidden comment: ERA-3AEB121V)
Y2  WMRAG32K76CS1C00R0  [FP-WMRAG32K76CS1C00R0-MFG]

### Nets
GND: C22.1 C23.1 C24.1 C25.2 C26.2 C27.1 C28.1 D8.1(C) MD1.1(GND) MD1.15(GND) MD1.38(GND) MD1.39(GND) Y2.2(GND)
VCC: C22.2 C23.2 C24.2 C25.1 C26.1 R39.1 R40.2 R43.1
A0: MD1.26(IO4)  [also labelled IO4]
A1: MD1.13(IO14)  [also labelled IO14]
A2: MD1.23(IO15)  [also labelled IO15]
A3: MD1.27(IO16)  [also labelled IO16]
A4: MD1.28(IO17)  [also labelled IO17]
A5: MD1.31(IO19)  [also labelled IO19]
BNO055_INT: MD1.29(IO5)  [also labelled IO5]
BNO055_RESET: MD1.24(IO2)  [also labelled IO2]
CLK: MD1.20(CLK)
CMD: MD1.19(CMD)
EN: MD1.3(EN) R40.1
I2C_SCL: MD1.37(IO23)  [also labelled IO23]
I2C_SCL2: MD1.33(IO21)  [also labelled IO21]
I2C_SCL3: MD1.14(IO12)  [also labelled IO12]
I2C_SDA: MD1.30(IO18)  [also labelled IO18]
I2C_SDA2: MD1.36(IO22)  [also labelled IO22]
I2C_SDA3: MD1.16(IO13)  [also labelled IO13]
IO0: MD1.25(IO0)
IO25: MD1.10(IO25)
IO26: MD1.11(IO26)
IO27: MD1.12(IO27)
IO32: MD1.8(IO32) R41.1
IO33: MD1.9(IO33) R42.1
IO34: MD1.6(IO34)
IO35: MD1.7(IO35)
RXD0: MD1.34(RXD0)
SD0: MD1.21(SD0)
SD1: MD1.22(SD1)
SD2: MD1.17(SD2)
SD3: MD1.18(SD3)
SENSOR_VN: MD1.5(SENSOR_VN)
SENSOR_VP: MD1.4(SENSOR_VP)
TXD0: MD1.35(TXD0)
NetC27_2: C27.2 R41.2 Y2.1(Xin)
NetC28_2: C28.2 R42.2 Y2.3(Xout)
NetD8_2: D8.2(A) R43.2
NetMD1_2: MD1.2(3V3) R39.2

Not connected (* = marked no-connect by the designer): MD1 32(NC)*; Y2 4(GND/NC)*

### Notes on the sheet
- Title
- Size:
- Date:
- A3
- Number:
- Time:
- Revision:
- Sheet
- of
- File:

### Library data of the parts
C22 C23 = CMP-2006-03318-1: Manufacturer: Kemet; Part Number: C0603C101J1GACTU
C24 = CMP-2007-03453-1: Manufacturer: Murata; Part Number: GRM21BR61C106KE15L
C25 C26 = CMP-03020-016578-1: as C1 on sheet 01_powersupply; RoHS: TRUE; Temperature: -55°C to +125°C; Automotive: Yes; Device Class L3: Ceramic Capacitors; Temperature Characteristic: X7R; Package: C0603C-CF; Digikey Description: CAP CER 0.1UF 16V X7R 0603; Manufacturer Part Number: C0603C104M4RAC7411; ComponentLink2URL: https://api.kemet.com/component-edge/download/datasheet/C0603C100J5GACAUTO.pdf; Mouser Description: Multilayer Ceramic Capacitors MLCC - SMD/SMT 16volts 0.1uF X7R 20%; Voltage Rating: 16 V; Temperature Range High: +125°C; Temperature Range Low: -55°C; Height: 0.87mm; Device Class L1: Passive Components; ComponentLink2Description: Datasheet; Lead Free: Yes; Category: Cap; Device Class L2: Capacitors; Octopart: https://octopart.com/c0603c104m4rac7411-kemet-9138805
C27 C28 = CMP-1659-00031-1: as C15 on sheet 04_IMU; Mount: Through Hole; Length: 0.248 inch; PackageReference: 0603; DatasheetVersion: Rev. 14, 07/2016; Packaging: Bulk; Max Operating Temperature: 155 degC; Min Operating Temperature: -55 degC; ComponentLink2Description: Datasheet; ComponentLink2URL: http://www.yageo.com/NewPortal/yageodocoutput?fileName=/pdf/MLCC/UPY-GP_NP0_16V-to-50V_14.pdf; ComponentLink1URL: http://www.yageo.com/; PackageDescription: 2-Pin Surface Mount Device, Body 1.6 x 0.8 mm; Package Quantity: 200; RoHSCompliant: true; ComponentLink1Description: Manufacturer URL
D8 = CMP-22017-000005-1: as D9 on sheet 02_USB2UART; Packaging: Tape and Reel; Lens Transparency: Clear; Min Operating Temperature: -55°C; Case Code (Metric): 1608; Lens Style: Clear; Case/Package: 0603; Mount: Surface Mount; Package Quantity: 1; Height: 0.8mm; Illumination Color: Green; Radiation Hardening: No; Depth: 0.8mm; Number of Pins: 2; Max Operating Temperature: 85°C; Color: Green; Number of Elements: 1; Power Rating: 100mW; Case Code (Imperial): 0603; Width: 0.8mm; Length: 1.6mm; Lead Free: Lead Free
MD1 = CMP-194065-000003-1: WIFI MODULE 32MBITS SPI FLASH; Manufacturer: Espressif Systems; Max Supply Voltage: 3.6V; Nominal Supply Current: 500mA; Max Frequency: 2484MHz; Number Of Adc Channels: 16; Number Of Gpio: 32; Interface: I2C,SPI,UART,Ethernet,I2S,Other; Data Rate: 150Mbits/s; Min Supply Voltage: 3V; Bandwidth: 72MHz; Sensitivity: -98dBm; Octopart: https://octopart.com/esp32-wroom-32d-espressif+systems-91040050; Package: ESP32-WROOM-32D; ComponentLink2URL: https://www.espressif.com/sites/default/files/documentation/esp32-wroom-32d_esp32-wroom-32u_datasheet_en.pdf; Lead Free: Yes; Category: UNK; Mouser Description: Wi-Fi/BT BLE Module ESP32-D0WD, SPI Flash, UART, P; Device Class L1: Integrated Circuits (ICs); RoHS: TRUE; Temperature Range Low: -40°C; ComponentLink2Description: Datasheet; Digikey Description: WIFI MODULE 32MBITS SPI FLASH; Height: 3.2mm; Temperature: -40°C to +85°C; Manufacturer Part Number: ESP32-WROOM-32D; Device Class L3: Transceivers; Device Class L2: RF Semiconductors and Devices; Temperature Range High: +85°C; Automotive: No
R39 R41 R42 = CMP-2100-03667-1: as R2 on sheet 02_USB2UART; Width: 0.8mm; Max Operating Temperature: 155degC; Tolerance: 5%; Package Reference: 0603; Height: 0.45mm; Depth: 0.8mm; Package Description: 2-Pin Surface Mount Device, Body 1.6 x 0.8 mm; Termination: SMD/SMT; Package Quantity: 5000; Case/Package: 0603; Case Code (Imperial): 0603; Radiation Hardening: No; Number of Pins: 2; Length: 1.6mm; Lead Free: LeadFree; Voltage Rating (DC): 50V; Military Standard: Not; Datasheet URL: http://www.yageo.com/NewPortal/yageodocoutput?fileName=/pdf/R-Chip/PYu-RC_Group_51_RoHS_L_5.pdf; Manufacturer URL: http://www.yageo.com/; Packaging: TapeandReel; Case Code (Metric): 1608; Min Operating Temperature: -55degC; Composition: ThickFilm; RoHSCompliant: true; Contact Plating: Tin; Datasheet Version: Rev. 5, 10/2016; REACH SVHC: NoSVHC
R40 = CMP-2000-05022-1: Resistor, 10 KOhm, +/- 5%, 100 mW, -55 to 155 degC, 0603 (1608 Metric), RoHS, Tape and Reel; Manufacturer: Yageo; Voltage Rating: 50V; Temperature Coefficient: 100PPM/C; Power Rating: 100mW; Package Reference: 603; Series: RC; Case Code - mm: 1608; Packaging: Reel; Datasheet URL: http://www.farnell.com/datasheets/443971.pdf; Datasheet Version: Rev. 4, 04/2009; Operating Temperature Range: -55Cto+155C; Product: ThickFilmResistorsGeneralPurpose; Package Description: 2-Pin Surface Mount Device, Body 1.6 x 0.8 mm; Manufacturer URL: http://www.yageo.com/; Case Code - in: 0603; Tolerance: 5%; Termination Style: SMD/SMT
R43 = CMP-2000-00896-1: Manufacturer: Panasonic; Part Number: ERA-3AEB121V
Y2 = CMP-06054-000002-1: as Y1 on sheet 04_IMU; Temperature Range High: +85°C; Manufacturer Part Number: WMRAG32K76CS1C00R0; Device Class L2: Crystals / Oscillators; Category: Crys; ComponentLink2URL: https://www.murata.com/en-us/products/productdetail?partno=WMRAG32K76CS1C00R0; Package: WMRAG32K76CS1C00R0; Temperature: -30°C to +85°C; Automotive: No; Device Class L1: Passive Components; Octopart: https://octopart.com/wmrag32k76cs1c00r0-murata-103936783; ComponentLink2Description: Datasheet; RoHS: TRUE; Lead Free: Yes; Device Class L3: Crystals; Footprint Url: https://forum.upverter.com/uploads/default/original/3X/c/9/c928dfaf44ae48bfe51164a60c1d28063cd1860b.pdf; Temperature Range Low: -30°C

## Nets that join several sheets
GND: 01_powersupply (11 pins), 02_USB2UART (20 pins), 03_pushswitch (C12.2 C13.2 R10.1 R11.1), 04_IMU (15 pins), 05_PWMdriver (26 pins), 08_CoreBoard (13 pins)
PWM_VDD: 01_powersupply (6 pins), 02_USB2UART (D1.2), 05_PWMdriver (18 pins)
VCC: 02_USB2UART (9 pins), 04_IMU (8 pins), 05_PWMdriver (D4.2 P3.2 R22.2 R23.2), 08_CoreBoard (8 pins)
A0: 05_PWMdriver (R25.1 U7.1), 08_CoreBoard (MD1.26)
A1: 05_PWMdriver (R26.1 U7.2), 08_CoreBoard (MD1.13)
A2: 05_PWMdriver (R27.1 U7.3), 08_CoreBoard (MD1.23)
A3: 05_PWMdriver (R28.1 U7.4), 08_CoreBoard (MD1.27)
A4: 05_PWMdriver (R29.1 U7.5), 08_CoreBoard (MD1.28)
A5: 05_PWMdriver (R30.1 U7.24), 08_CoreBoard (MD1.31)
BNO055_INT: 04_IMU (R15.2), 08_CoreBoard (MD1.29)
BNO055_RESET: 04_IMU (R16.1), 08_CoreBoard (MD1.24)
DTR: 02_USB2UART (U5.23), 03_pushswitch (Q2.3 R6.1)
EN: 03_pushswitch (C12.1 Q1.2 R8.2), 08_CoreBoard (MD1.3 R40.1)
I2C_SCL: 04_IMU (P2.3 R13.1 U6.19), 08_CoreBoard (MD1.37)
I2C_SCL2: 05_PWMdriver (P3.3 R23.1 U7.26), 08_CoreBoard (MD1.33)
I2C_SDA: 04_IMU (P2.4 R12.1 U6.20), 08_CoreBoard (MD1.30)
I2C_SDA2: 05_PWMdriver (P3.4 R22.1 U7.27), 08_CoreBoard (MD1.36)
IO0: 03_pushswitch (C13.1 Q2.2 R9.2), 08_CoreBoard (MD1.25)
RTS: 02_USB2UART (U5.19), 03_pushswitch (Q1.3 R7.1)
RXD0: 02_USB2UART (P1.2 U5.21), 08_CoreBoard (MD1.34)
TXD0: 02_USB2UART (P1.3 U5.20), 08_CoreBoard (MD1.35)
USB5V4: 02_USB2UART (D2.2 D3.2 J1.1 P1.1), 05_PWMdriver (D5.2 D7.2)